# Altium schematic sheet McBSP.SchDoc
size A4
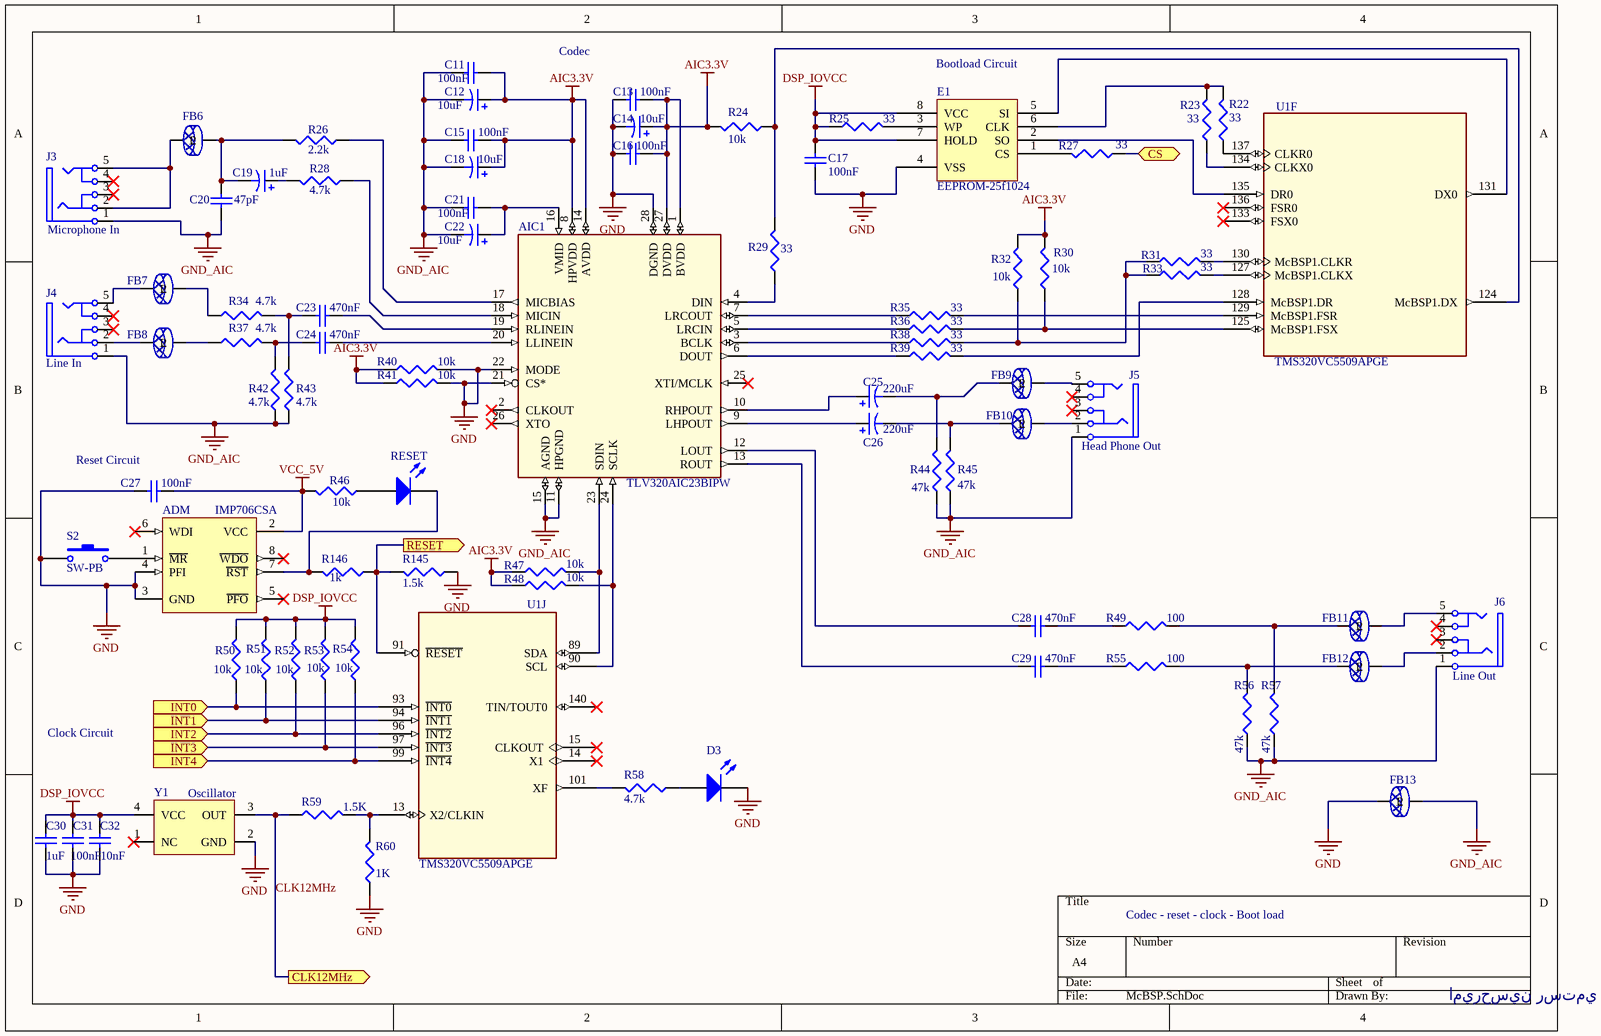
[diagram p0: McBSP.SchDoc]

## Parts
ADM  IMP706CSA  [SO-8_N]
AIC1  TLV320AIC23BIPW  [TSSOP28]
C11  100nF  [1608[0603]]
C12  10uF  [c1206]
C13  100nF  [1608[0603]]
C14  10uF  [c1206]
C15  100nF  [1608[0603]]
C16  100nF  [1608[0603]]
C17  100nF  [1608[0603]]
C18  10uF  [c1206]
C19  1uF  [c1206]
C20  47pF  [1608[0603]]
C21  100nF  [1608[0603]]
C22  10uF  [c1206]
C23  470nF  [1608[0603]]
C24  470nF  [1608[0603]]
C25  value 220uF  [TC7343-2917]  (hidden comment: Cap Pol3)
C26  220uF  [TC7343-2917]
C27  100nF  [1608[0603]]
C28  470nF  [1608[0603]]
C29  470nF  [1608[0603]]
C30  1uF  [1608[0603]]
C31  100nF  [1608[0603]]
C32  10nF  [1608[0603]]
D3  Green  [1.6x0.8x0.4]  (value not drawn)
E1  EEPROM-25f1024  [MX25l1605A]
FB6  50  [3216[1206]]  (value not drawn)
FB7  50  [3216[1206]]  (value not drawn)
FB8  50  [3216[1206]]  (value not drawn)
FB9  50  [3216[1206]]  (value not drawn)
FB10  50  [3216[1206]]  (value not drawn)
FB11  50  [3216[1206]]  (value not drawn)
FB12  50  [3216[1206]]  (value not drawn)
FB13  50  [3216[1206]]  (value not drawn)
J3  Microphone In  [stereo jack socket]
J4  Line In  [stereo jack socket]
J5  Head Phone Out  [stereo jack socket]
J6  Line Out  [stereo jack socket]
R22  33  [J1-0603]
R23  33  [J1-0603]
R24  10k  [J1-0603]
R25  33  [J1-0603]
R26  2.2k  [J1-0603]
R27  33  [J1-0603]
R28  4.7k  [J1-0603]
R29  33  [J1-0603]
R30  10k  [J1-0603]
R31  33  [J1-0603]
R32  10k  [J1-0603]
R33  33  [J1-0603]
R34  4.7k  [J1-0603]
R35  33  [J1-0603]
R36  33  [J1-0603]
R37  4.7K  [J1-0603]
R38  33  [J1-0603]
R39  33  [J1-0603]
R40  10k  [J1-0603]
R41  10k  [J1-0603]
R42  4.7k  [J1-0603]
R43  4.7k  [J1-0603]
R44  47k  [J1-0603]
R45  47k  [J1-0603]
R46  10k  [J1-0603]
R47  10k  [J1-0603]
R48  10k  [J1-0603]
R49  100  [J1-0603]
R50  10k  [J1-0603]
R51  10k  [J1-0603]
R52  10k  [J1-0603]
R53  10k  [J1-0603]
R54  10k  [J1-0603]
R55  100  [J1-0603]
R56  47k  [J1-0603]
R57  47k  [J1-0603]
R58  4.7k  [J1-0603]
R59  1.5k  [J1-0603]
R60  1k  [J1-0603]
R145  1.5k  [J1-0603]
R146  1k  [J1-0603]
RESET  LED RED  [1.6X0.8X0.4]  (value not drawn)
S2  SW-PB  [RESET_KEY]
U1  TMS320VC5509APGE  [TMSVC5509APGA]  (parts F,J of 16)
Y1  Oscillator  [Crystal oscillator]

## Ports
CLK12MHz (out), CS, INT0 (in), INT1 (in), INT2 (in), INT3 (in), INT4 (in), RESET (out)

## Nets
AIC3.3V: AIC1.1(BVDD) AIC1.8(HPVDD) AIC1.14(AVDD) AIC1.27(DVDD) C11.1 C12.1 C13.1 C14.1 C15.1 C16.1 C18.1 R24.2 R30.2 R32.2 R40.1 R41.1 R47.1 R48.1
DSP_IOVCC: C17.1 C30.1 C31.1 C32.1 E1.7(HOLD) E1.8(VCC) R25.1 R50.2 R51.2 R52.2 R53.2 R54.2 Y1.4(VCC)
GND: ADM.3(GND) ADM.4(PFI) AIC1.21(CS*) AIC1.22(MODE) AIC1.28(DGND) C13.2 C14.2 C16.2 C17.2 C27.1 C30.2 C31.2 C32.2 D3.2(K) E1.4(VSS) FB13.2 R40.2 R41.2 R60.1 R145.1 S2.1 Y1.2(GND)
GND_AIC: AIC1.11(HPGND) AIC1.15(AGND) C11.2 C12.2 C15.2 C18.2 C20.2 C21.2 C22.2 FB13.1 J3.1 J4.1 J5.1 J6.1 R42.1 R43.1 R44.1 R45.1 R56.1 R57.1
VCC_5V: ADM.2(VCC) C27.2 R46.2
CLK12MHz: R59.1 Y1.3(OUT) ; port CLK12MHz
CS: R27.1 ; port CS
INT0: R50.1 U1.93(~{INT0}) ; port INT0
INT1: R51.1 U1.94(~{INT1}) ; port INT1
INT2: R52.1 U1.96(~{INT2}) ; port INT2
INT3: R53.1 U1.97(~{INT3}) ; port INT3
INT4: R54.1 U1.99(~{INT4}) ; port INT4
RESET: R145.2 R146.1 U1.91(~{RESET}) ; port RESET
NetADM_1: ADM.1(~{MR}) S2.2
NetADM_7: ADM.7(~{RST}) R146.2 RESET.2(K)
NetAIC1_3: AIC1.3(BCLK) R38.1
NetAIC1_4: AIC1.4(DIN) R29.1
NetAIC1_5: AIC1.5(LRCIN) R36.1
NetAIC1_6: AIC1.6(DOUT) R39.1
NetAIC1_7: AIC1.7(LRCOUT) R35.1
NetAIC1_9: AIC1.9(LHPOUT) C26.1
NetAIC1_10: AIC1.10(RHPOUT) C25.1
NetAIC1_12: AIC1.12(LOUT) C28.2
NetAIC1_13: AIC1.13(ROUT) C29.2
NetAIC1_16: AIC1.16(VMID) C21.1 C22.1
NetAIC1_17: AIC1.17(MICBIAS) R26.1
NetAIC1_18: AIC1.18(MICIN) R28.1
NetAIC1_19: AIC1.19(RLINEIN) C23.1
NetAIC1_20: AIC1.20(LLINEIN) C24.1
NetAIC1_23: AIC1.23(SDIN) R47.2 U1.89(SDA)
NetAIC1_24: AIC1.24(SCLK) R48.2 U1.90(SCL)
NetC19_1: C19.1 R28.2
NetC19_2: C19.2 C20.1 FB6.1 R26.2
NetC23_2: C23.2 R34.2 R43.2
NetC24_2: C24.2 R37.2 R42.2
NetC25_2: C25.2 FB9.2 R44.2
NetC26_2: C26.2 FB10.2 R45.2
NetC28_1: C28.1 R49.1
NetC29_1: C29.1 R55.1
NetD3_1: D3.1(A) R58.1
NetE1_1: E1.1(CS) R27.2
NetE1_2: E1.2(SO) U1.135(DR0)
NetE1_3: E1.3(WP) R25.2
NetE1_5: E1.5(SI) U1.131(DX0)
NetE1_6: E1.6(CLK) R22.2 R23.2
NetFB6_2: FB6.2 J3.2 J3.5
NetFB7_1: FB7.1 R34.1
NetFB7_2: FB7.2 J4.5
NetFB8_1: FB8.1 R37.1
NetFB8_2: FB8.2 J4.2
NetFB9_1: FB9.1 J5.5
NetFB10_1: FB10.1 J5.2
NetFB11_1: FB11.1 J6.5
NetFB11_2: FB11.2 R49.2 R57.2
NetFB12_1: FB12.1 J6.2
NetFB12_2: FB12.2 R55.2 R56.2
NetR22_1: R22.1 U1.137(CLKR0)
NetR23_1: R23.1 U1.134(CLKX0)
NetR24_1: R24.1 R29.2 U1.124(McBSP1.DX)
NetR30_1: R30.1 R36.2 U1.125(McBSP1.FSX)
NetR31_1: R31.1 R32.1 R33.1 R38.2
NetR31_2: R31.2 U1.130(McBSP1.CLKR)
NetR33_2: R33.2 U1.127(McBSP1.CLKX)
NetR35_2: R35.2 U1.129(McBSP1.FSR)
NetR39_2: R39.2 U1.128(McBSP1.DR)
NetR46_1: R46.1 RESET.1(A)
NetR58_2: R58.2 U1.101(XF)
NetR59_2: R59.2 R60.2 U1.13(X2/CLKIN)

Not connected (* = marked no-connect by the designer): ADM 5(~{PFO})* 6(WDI)* 8(~{WDO})*; AIC1 2(CLKOUT)* 25(XTI/MCLK)* 26(XTO)*; J3 3* 4*; J4 3* 4*; J5 3* 4*; J6 3* 4*; U1 14(X1)* 15(CLKOUT)* 133(FSX0)* 136(FSR0)* 140(TIN/TOUT0)*; Y1 1(NC)*

## Notes on the sheet
- Codec
- (near E1) Bootload Circuit
- (near C27) Reset Circuit
- Clock Circuit
- Codec - reset - clock - Boot load
- اميرحسين رستمي

## Library data of the parts
ADM = ADM706AR: Low-Cost uP Supervisory Circuit; Published: 8-Jun-2000; LatestRevisionDate: 13-Apr-2006; LatestRevisionNote: IPC-7351 Footprint Added.; DatasheetVersion: REV.A 1996; PackageVersion: revA; PackageReference: SO-8; Publisher: Altium Limited; PackageDescription: 8-Pin Small Outline Integrated Circuit 1.27 mm Pitch; Code_JEDEC: MS-012-AA; Code_IPC: SOIC127P600-8; ComponentLink1Description: Manufacturer Link; ComponentLink1URL: http://www.analog.com/en/prod/0%2C2877%2CADM705%2C00.html; ComponentLink2Description: Datasheet; ComponentLink2URL: http://www.analog.com/UploadedFiles/Data_Sheets/28178114ADM705_6_7_8_c.pdf
C11 C13 C15-C17 C21 C23 C24 C27 C28 C30-C32 = Cap Semi: Capacitor; Published: 8-Jun-2000; LatestRevisionDate: 17-Jul-2002; LatestRevisionNote: Re-released for DXP Platform.; PackageReference: C1206; Publisher: Altium Limited
  C11 C13 C15-C17 C21 C27 C31: Value: 100nF
  C23 C24 C28: Value: 470nF
  C30: Value: 1uF
  C32: Value: 10nF
C12 C14 C18 C22 = Cap Pol3: Polarized Capacitor (Tantalium); Published: 8-Jun-2000; LatestRevisionDate: 17-Jul-2002; LatestRevisionNote: Re-released for DXP Platform.; PackageReference: C0805; Publisher: Altium Limited; Value: 10uF
C19 C26 = Cap Pol3: Polarized Capacitor; Published: 8-Jun-2000; LatestRevisionDate: 17-Jul-2002; LatestRevisionNote: Re-released for DXP Platform.; PackageReference: C0805; Publisher: Altium Limited
  C19: Value: 1uF
  C26: Value: 220uF
C20 C29 = Cap Semi: Capacitor (Semiconductor SIM Model); Published: 8-Jun-2000; LatestRevisionDate: 17-Jul-2002; LatestRevisionNote: Re-released for DXP Platform.; PackageReference: C1206; Publisher: Altium Limited
  C20: Value: 47pF
  C29: Value: 470nF
C25 = Cap Pol3: Polarized Capacitor (Surface Mount); Published: 8-Jun-2000; LatestRevisionDate: 17-Jul-2002; LatestRevisionNote: Re-released for DXP Platform.; PackageReference: C0805; Publisher: Altium Limited
D3 RESET = LED3: LED; Published: 8-Jun-2000; LatestRevisionDate: 17-Dec-2003; LatestRevisionNote: PCB Footprint replaced.; DatasheetDocument: 16-Apr-2002; PackageDocument: 16-Apr-2002; PackageReference: 3.5X2.8X1.9; Publisher: Altium Limited
E1 = EEPROM_25_256
FB6-FB13 = Ferrite Bead
J3-J6 = Stereo Jack Socket
R22-R60 R145 R146 = Res3: Resistor; Published: 8-Jun-2000; LatestRevisionDate: 04-Mar-2005; LatestRevisionNote: PCB Footprint replaced.; PackageReference: J1-0603; Publisher: Altium Limited
  R22 R23 R25 R27 R29 R31 R33 R35 R36 R38 R39: Value: 33
  R24 R30 R32 R40 R41 R46-R48 R50-R54: Value: 10k
  R26: Value: 2.2k
  R28 R34 R37 R42 R43 R58: Value: 4.7k
  R44 R45 R56 R57: Value: 47k
  R49 R55: Value: 100
  R59: Value: 1.5K
  R60: Value: 1K
  R145: Value: 1.5k
  R146: Value: 1k
S2 = SW-PB: Switch; Published: 24-Mar-1999; LatestRevisionDate: 17-Jul-2002; LatestRevisionNote: Re-released for DXP Platform.; PackageReference: SPST-2; Publisher: Altium Limited
Y1 = Crystall Oscillaotr